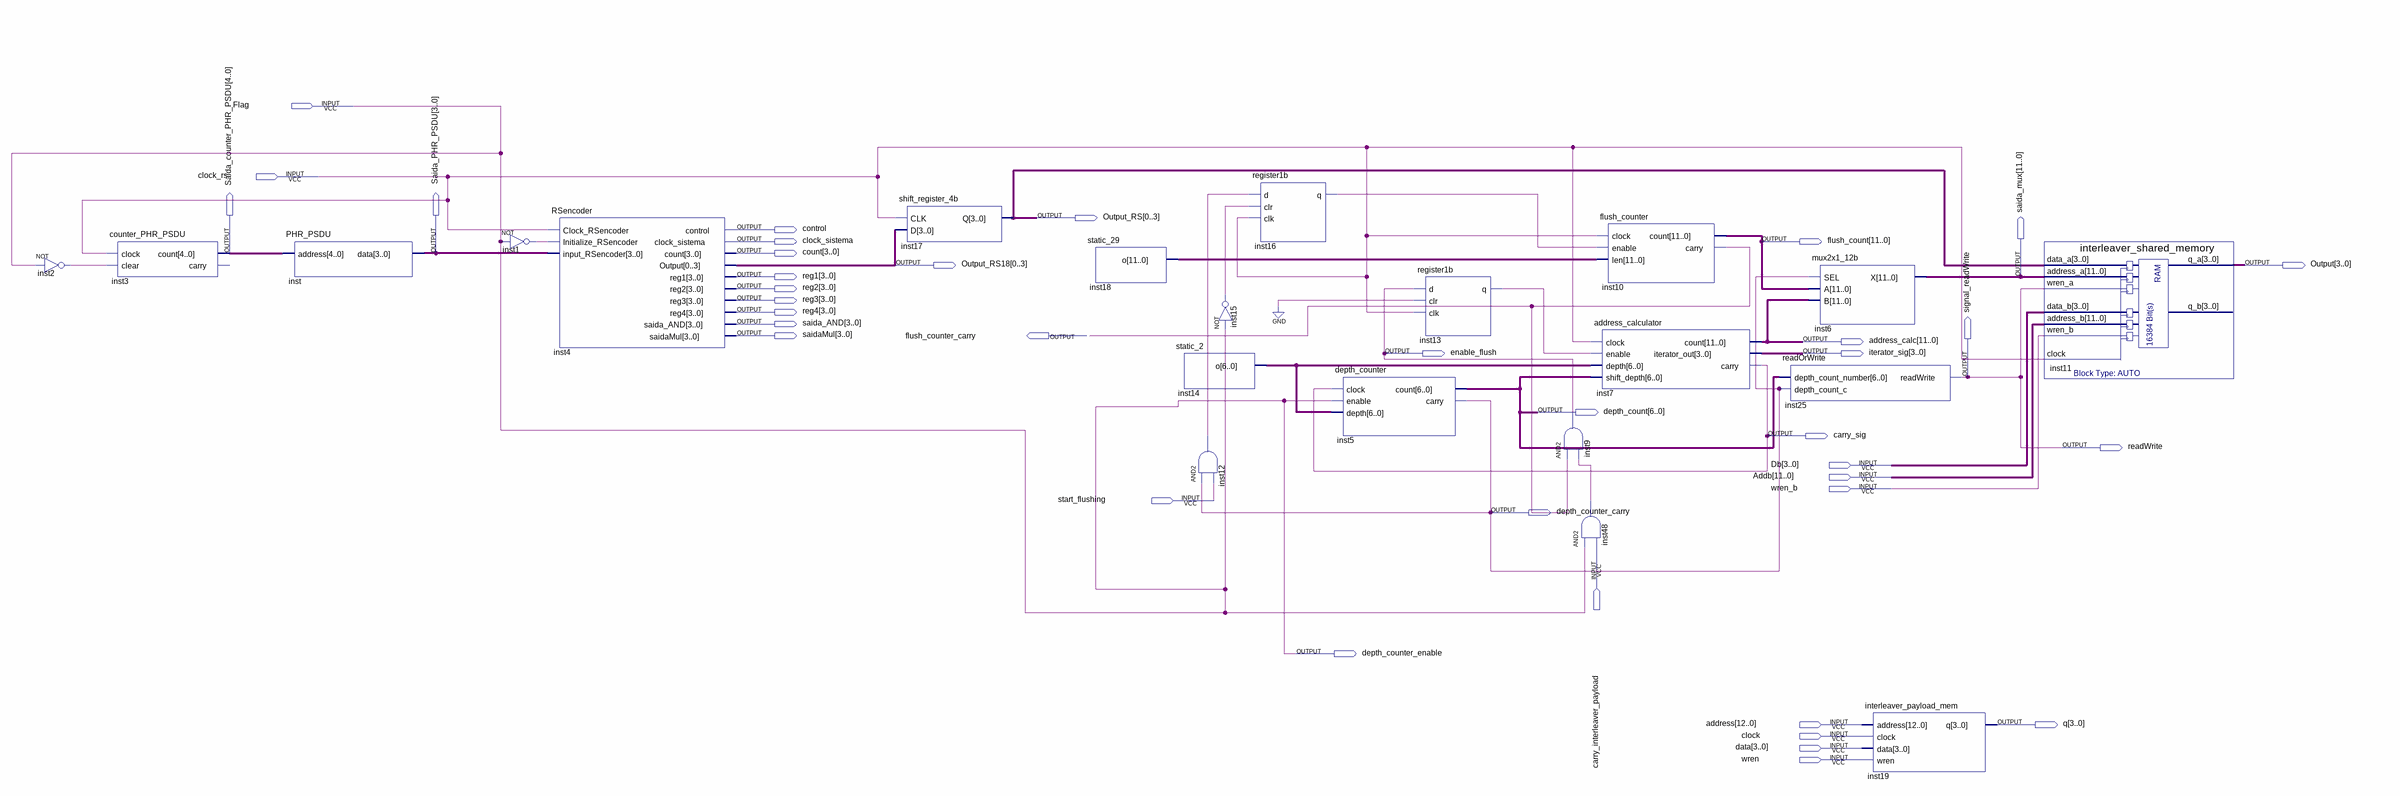
[diagram p0: schematic sheet]
// Quartus schematic EncIntegration.bdf as structural Verilog: 21 symbols, 38 pins
module EncIntegration (
  input  Flag,
  input  clock_rs,
  input  [3:0] Db,
  input  [11:0] Addb,
  input  wren_b,
  input  start_flushing,
  input  carry_interleaver_payload,
  input  [12:0] address,
  input  clock,
  input  [3:0] data,
  input  wren,
  output [0:3] Output_RS,
  output control,
  output clock_sistema,
  output [11:0] flush_count,
  output [4:0] Saida_counter_PHR_PSDU,
  output [3:0] Saida_PHR_PSDU,
  output [3:0] count,
  output [0:3] Output_RS18,
  output [3:0] Output,
  output [3:0] reg1,
  output [11:0] saida_mux,
  output [3:0] reg2,
  output [3:0] reg3,
  output [3:0] reg4,
  output [3:0] saida_AND,
  output [3:0] saidaMul,
  output flush_counter_carry,
  output [11:0] address_calc,
  output enable_flush,
  output [3:0] iterator_sig,
  output signal_readWrite,
  output [6:0] depth_count,
  output carry_sig,
  output readWrite,
  output depth_counter_carry,
  output depth_counter_enable,
  output [3:0] q
);

  wire inst1_out, inst2_out, inst12_out, inst13_q, inst15_out, inst16_q, inst48_out;
  wire [6:0] inst14_o;
  wire [11:0] inst18_o;

  not inst2 (inst2_out, Flag);
  counter_PHR_PSDU inst3 (.clock(clock_rs), .clear(inst2_out), .count(Saida_counter_PHR_PSDU));  // open: carry
  PHR_PSDU inst (.address(Saida_counter_PHR_PSDU), .data(Saida_PHR_PSDU));
  not inst1 (inst1_out, Flag);
  RSencoder inst4 (
    .Clock_RSencoder(clock_rs), .Initialize_RSencoder(inst1_out), .input_RSencoder(Saida_PHR_PSDU),
    .control(control), .clock_sistema(clock_sistema), .count(count), .Output(Output_RS18), .reg1(reg1),
    .reg2(reg2), .reg3(reg3), .reg4(reg4), .saida_AND(saida_AND), .saidaMul(saidaMul));
  shift_register_4b inst17 (.CLK(clock_rs), .D(Output_RS18), .Q(Output_RS));
  static_29 inst18 (.o(inst18_o));
  static_2 inst14 (.o(inst14_o));
  not inst15 (inst15_out, Flag);
  and inst12 (inst12_out, depth_counter_carry, start_flushing);
  register1b inst16 (.d(inst12_out), .clr(inst15_out), .clk(clock_rs), .q(inst16_q));
  depth_counter inst5 (
    .clock(carry_sig), .enable(Flag), .depth(inst14_o), .count(depth_count), .carry(depth_counter_carry));
  register1b inst13 (.d(enable_flush), .clr(1'b0), .clk(clock_rs), .q(inst13_q));
  flush_counter inst10 (
    .clock(clock_rs), .enable(inst16_q), .len(inst18_o), .count(flush_count), .carry(flush_counter_carry));
  address_calculator inst7 (
    .clock(clock_rs), .enable(inst13_q), .depth(inst14_o), .shift_depth(depth_count), .count(address_calc),
    .iterator_out(iterator_sig), .carry(carry_sig));
  and inst9 (enable_flush, flush_counter_carry, inst48_out);
  and inst48 (inst48_out, Flag, carry_interleaver_payload);
  readOrWrite inst25 (.depth_count_number(depth_count), .depth_count_c(depth_counter_carry), .readWrite(readWrite));
  mux2x1_12b inst6 (.SEL(depth_counter_carry), .A(flush_count), .B(address_calc), .X(saida_mux));
  interleaver_payload_mem inst19 (.address(address), .clock(clock), .data(data), .wren(wren), .q(q));
  interleaver_shared_memory inst11 (
    .data_a(Output_RS), .address_a(saida_mux), .wren_a(readWrite), .data_b(Db), .address_b(Addb),
    .wren_b(wren_b), .clock(clock_rs), .q_a(Output));  // open: q_b

  assign depth_counter_enable = Flag;
  assign signal_readWrite = readWrite;
endmodule
